# EAGLE design PowerRhythm32 (EAGLE 6.4)
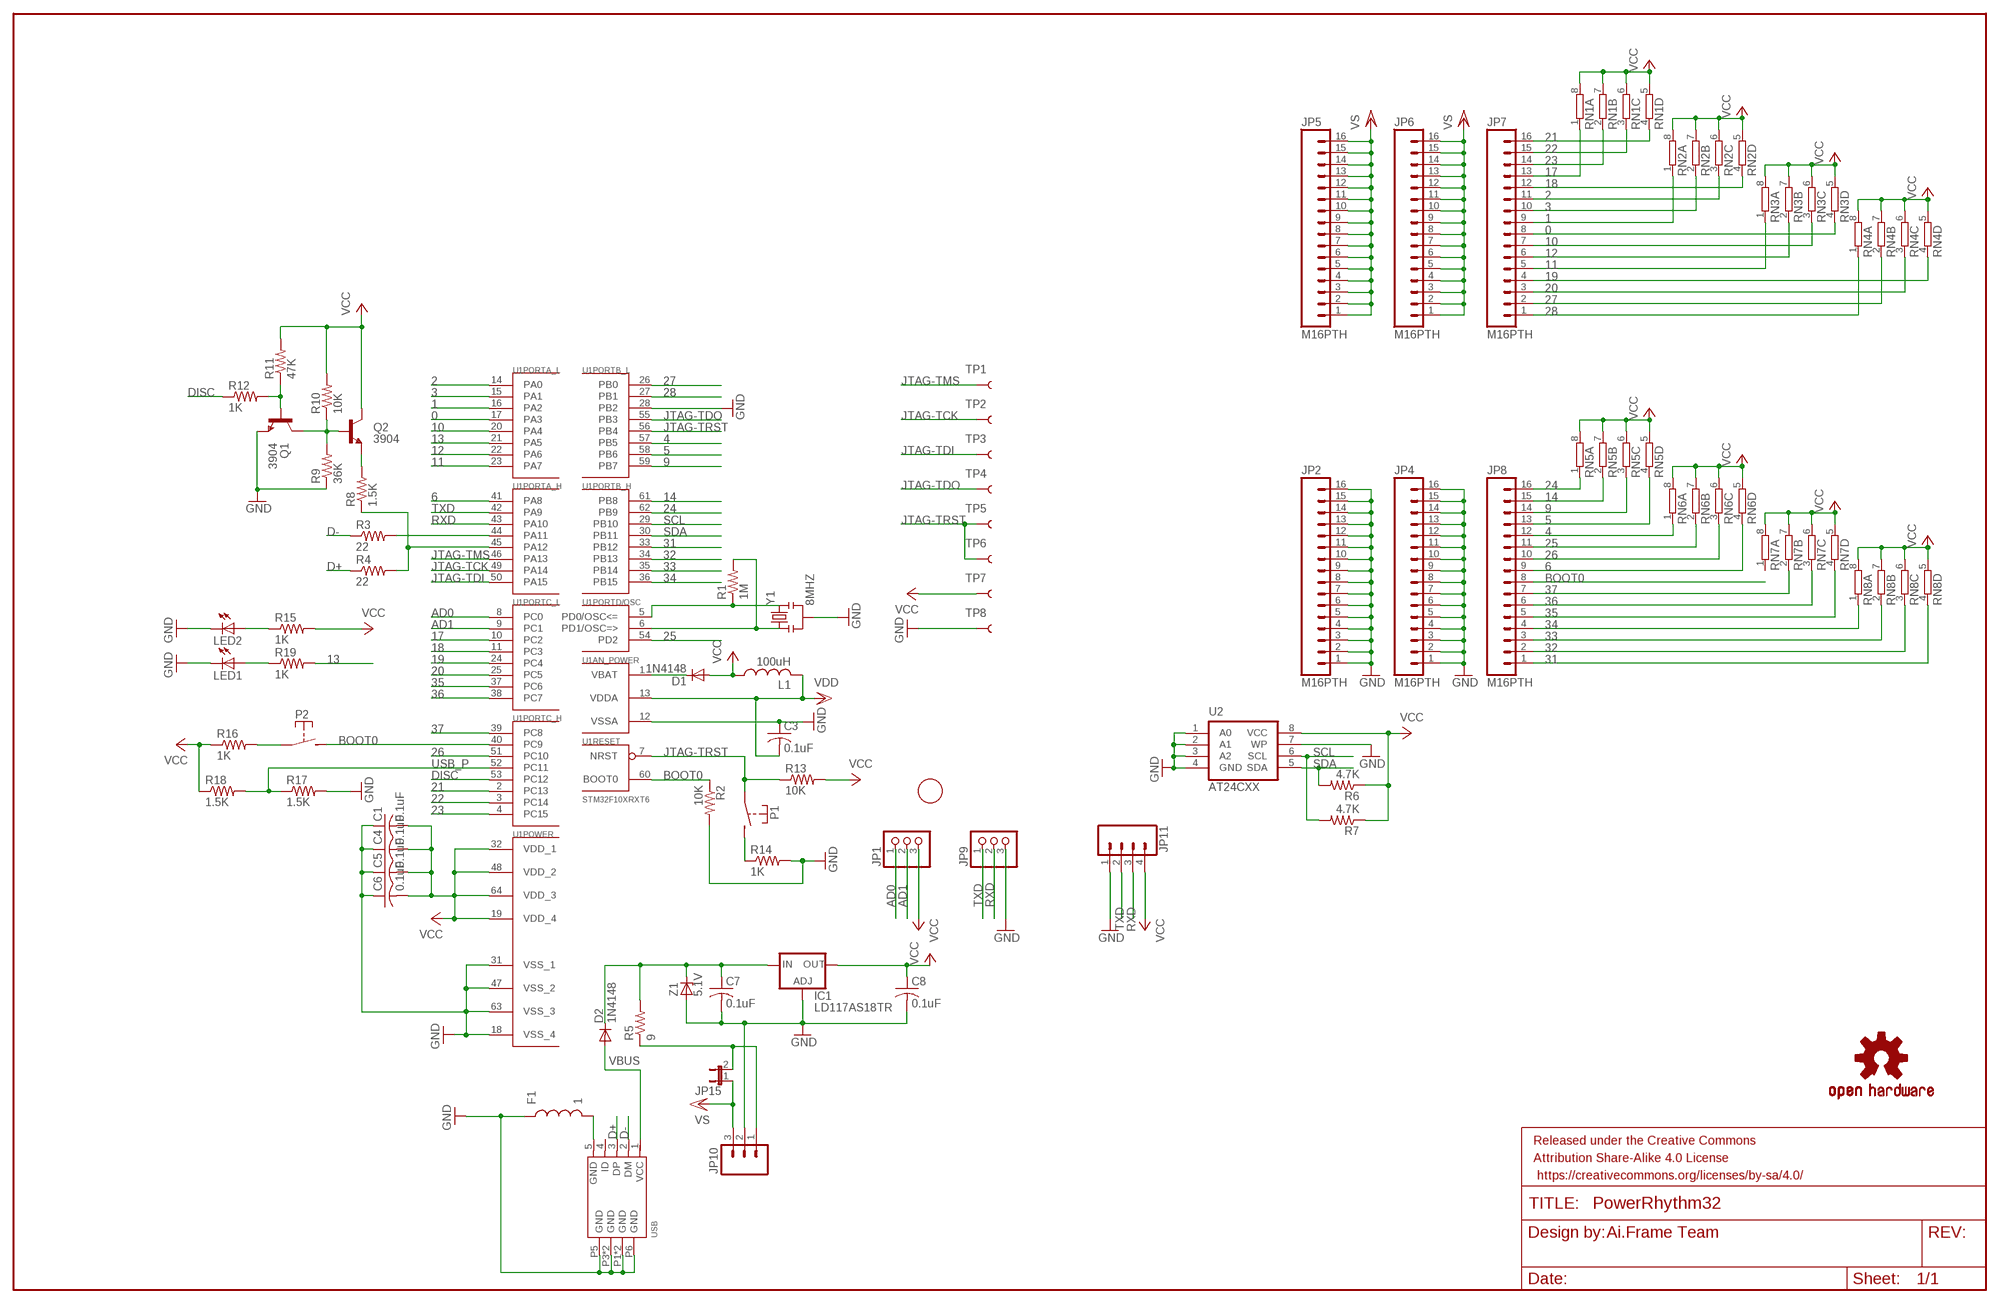
[diagram p0: schematic, sheet 1]

## Parts
C1  0.1uF  C-USC0603K  [C0603K]
C3  0.1uF  C-USC0603K  [C0603K]
C4  0.1uF  C-USC0603K  [C0603K]
C5  0.1uF  C-USC0603K  [C0603K]
C6  0.1uF  C-USC0603K  [C0603K]
C7  0.1uF  C-USC0603K  [C0603K]
C8  0.1uF  C-USC0603K  [C0603K]
D1  1N4148  DIODE-SOD123  [SOD123]
D2  1N4148  DIODE-SOD123  [SOD123]
F1  1  INDUCTOR0805  [0805]
FRAME1  FRAME-LEDGER  [CREATIVE_COMMONS]
IC1  LD117AS18TR  [SOT223]
JP1  PINHD-1X3  [1X03]
JP2  M16PTH  [1X16]
JP4  M16PTH  [1X16]
JP5  M16PTH  [1X16]
JP6  M16PTH  [1X16]
JP7  M16PTH  [1X16]
JP8  M16PTH  [1X16]
JP9  PINHD-1X3  [1X03]
JP10  M03SCREW_LOCK  [SCREWTERMINAL-3.5MM-3_LOCK.007S]
JP11  M04PTH  [1X04]
JP15  JUMPER-2PTH  [1X02]
L1  100uH  L-USL2012C  [L2012C]
LED1  LEDCHIP-LED0603  [CHIP-LED0603]
LED2  LEDCHIP-LED0603  [CHIP-LED0603]
LOGO1  OSHW-LOGOS  [OSHW-LOGO-S]
P1  TMAV433BAA  [TMAV433BAA]
P2  TMAV433BAA  [TMAV433BAA]
Q1  3904  TRANSISTOR_NPNMMBT2222A  [SOT23-3]
Q2  3904  TRANSISTOR_NPNMMBT2222A  [SOT23-3]
R1  1M  R-US_R0603  [R0603]
R2  10K  R-US_R0603  [R0603]
R3  22  R-US_R0603  [R0603]
R4  22  R-US_R0603  [R0603]
R5  9  R-US_R1206  [R1206]
R6  4.7K  R-US_R0603  [R0603]
R7  4.7K  R-US_R0603  [R0603]
R8  1.5K  R-US_R0603  [R0603]
R9  36K  R-US_R0603  [R0603]
R10  10K  R-US_R0603  [R0603]
R11  47K  R-US_R0603  [R0603]
R12  1K  R-US_R0603  [R0603]
R13  10K  R-US_R0603  [R0603]
R14  1K  R-US_R0603  [R0603]
R15  1K  R-US_R0603  [R0603]
R16  1K  R-US_R0603  [R0603]
R17  1.5K  R-US_R0603  [R0603]
R18  1.5K  R-US_R0603  [R0603]
R19  1K  R-US_R0603  [R0603]
RN1  4R-N0603-ARC  [0603-ARC]
RN2  4R-N0603-ARC  [0603-ARC]
RN3  4R-N0603-ARC  [0603-ARC]
RN4  4R-N0603-ARC  [0603-ARC]
RN5  4R-N0603-ARC  [0603-ARC]
RN6  4R-N0603-ARC  [0603-ARC]
RN7  4R-N0603-ARC  [0603-ARC]
RN8  4R-N0603-ARC  [0603-ARC]
TP1  TEST-POINT3X5  [PAD.03X.05]
TP2  TEST-POINT3X5  [PAD.03X.05]
TP3  TEST-POINT3X5  [PAD.03X.05]
TP4  TEST-POINT3X5  [PAD.03X.05]
TP5  TEST-POINT3X5  [PAD.03X.05]
TP6  TEST-POINT3X5  [PAD.03X.05]
TP7  TEST-POINT3X5  [PAD.03X.05]
TP8  TEST-POINT3X5  [PAD.03X.05]
U1  STM32F10XRXT6  [TQFP64]
U2  AT24CXX  [SO08-8S1]
U$1  FIDUCIAL  [FIDUCIAL_1MM]
USB  MICRO-USB5+4P'5+6P'  [MICRO-USB5+6P-SMD-0.65-AB]
Y1  8MHZ  RESONATOR8MHZ  [RESONATOR-SMD]
Z1  5.1V  ZENER-DIODESOD80C  [SOD80C]

## Nets
0: JP7.8 RN3.4 U1.17(PORTA_L:PA3)
1: JP7.9 RN2.1 U1.16(PORTA_L:PA2)
2: JP7.11 RN2.3 U1.14(PORTA_L:PA0)
3: JP7.10 RN2.2 U1.15(PORTA_L:PA1)
4: JP8.12 RN6.1 U1.57(PORTB_L:PB5)
5: JP8.13 RN5.4 U1.58(PORTB_L:PB6)
6: JP8.9 RN6.4 U1.41(PORTA_H:PA8)
9: JP8.14 RN5.3 U1.59(PORTB_L:PB7)
10: JP7.7 RN3.3 U1.20(PORTA_L:PA4)
11: JP7.5 RN3.1 U1.23(PORTA_L:PA7)
12: JP7.6 RN3.2 U1.22(PORTA_L:PA6)
13: R19.2 U1.21(PORTA_L:PA5)
14: JP8.15 RN5.2 U1.61(PORTB_H:PB8)
17: JP7.13 RN1.1 U1.10(PORTC_L:PC2)
18: JP7.12 RN2.4 U1.11(PORTC_L:PC3)
19: JP7.4 RN4.4 U1.24(PORTC_L:PC4)
20: JP7.3 RN4.3 U1.25(PORTC_L:PC5)
21: JP7.16 RN1.4 U1.2(PORTC_H:PC13)
22: JP7.15 RN1.3 U1.3(PORTC_H:PC14)
23: JP7.14 RN1.2 U1.4(PORTC_H:PC15)
24: JP8.16 RN5.1 U1.62(PORTB_H:PB9)
25: JP8.11 RN6.2 U1.54(PORTD/OSC:PD2)
26: JP8.10 RN6.3 U1.51(PORTC_H:PC10)
27: JP7.2 RN4.2 U1.26(PORTB_L:PB0)
28: JP7.1 RN4.1 U1.27(PORTB_L:PB1)
31: JP8.1 RN8.4 U1.33(PORTB_H:PB12)
32: JP8.2 RN8.3 U1.34(PORTB_H:PB13)
33: JP8.3 RN8.2 U1.35(PORTB_H:PB14)
34: JP8.4 RN8.1 U1.36(PORTB_H:PB15)
35: JP8.5 RN7.4 U1.37(PORTC_L:PC6)
36: JP8.6 RN7.3 U1.38(PORTC_L:PC7)
37: JP8.7 RN7.2 U1.39(PORTC_H:PC8)
AD0: JP1.1 U1.8(PORTC_L:PC0)
AD1: JP1.2 U1.9(PORTC_L:PC1)
BOOT0: JP8.8 P2.P$2(S) R2.1 U1.40(PORTC_H:PC9) U1.60(RESET:BOOT0)
D+: R4.1 USB.3(DP)
D-: R3.1 USB.2(DM)
DISC: R12.1 U1.53(PORTC_H:PC12)
GND: C1.1 C3.1 C4.1 C5.1 C6.1 C7.2 C8.2 F1.1 IC1.1(ADJ) JP2.1 JP2.2 JP2.3 JP2.4 JP2.5 JP2.6 JP2.7 JP2.8 JP2.9 JP2.10 JP2.11 JP2.12 JP2.13 JP2.14 JP2.15 JP2.16 JP4.1 JP4.2 JP4.3 JP4.4 JP4.5 JP4.6 JP4.7 JP4.8 JP4.9 JP4.10 JP4.11 JP4.12 JP4.13 JP4.14 JP4.15 JP4.16 JP9.3 JP10.2 JP11.1 LED1.C LED2.C Q1.2(E) R2.2 R9.1 R14.2 R17.2 TP8.P$1 U1.12(AN_POWER:VSSA) U1.18(POWER:VSS_4) U1.28(PORTB_L:PB2) U1.31(POWER:VSS_1) U1.47(POWER:VSS_2) U1.63(POWER:VSS_3) U2.1(A0) U2.2(A1) U2.3(A2) U2.4(GND) U2.7(WP) USB.P1(GND) USB.P2(GND) USB.P3(GND) USB.P4(GND) USB.P5(GND) USB.P6(GND) Y1.2 Z1.A
JTAG-TCK: TP2.P$1 U1.49(PORTA_H:PA14)
JTAG-TDI: TP3.P$1 U1.50(PORTA_H:PA15)
JTAG-TDO: TP4.P$1 U1.55(PORTB_L:PB3)
JTAG-TMS: TP1.P$1 U1.46(PORTA_H:PA13)
JTAG-TRST: P1.P$1(P) R13.1 TP5.P$1 TP6.P$1 U1.7(RESET:NRST) U1.56(PORTB_L:PB4)
N$1: R1.2 U1.6(PORTD/OSC:PD1/OSC=>) Y1.1
N$2: D1.C U1.1(AN_POWER:VBAT)
N$3: LED2.A R15.1
N$4: R4.2 R8.1 U1.45(PORTA_H:PA12)
N$5: JP10.1 JP15.2 R5.1
N$6: R1.1 U1.5(PORTD/OSC:PD0/OSC<=) Y1.3
N$8: R3.2 U1.44(PORTA_H:PA11)
N$9: C7.1 D2.C IC1.3(IN) R5.2 Z1.C
N$11: LED1.A R19.1
N$12: F1.2 USB.5(GND)
N$14: Q1.3(C) Q2.1(B) R9.2 R10.1
N$15: P1.P$2(S) R14.1
N$16: Q2.2(E) R8.2
N$17: Q1.1(B) R11.1 R12.2
N$19: P2.P$1(P) R16.2
RXD: JP9.2 JP11.3 U1.43(PORTA_H:PA10)
SCL: R7.2 U1.29(PORTB_H:PB10) U2.6(SCL)
SDA: R6.2 U1.30(PORTB_H:PB11) U2.5(SDA)
TXD: JP9.1 JP11.2 U1.42(PORTA_H:PA9)
USB_P: R17.1 R18.2 U1.52(PORTC_H:PC11)
VBUS: D2.A USB.1(VCC)
VCC: C1.2 C4.2 C5.2 C6.2 C8.1 D1.A IC1.4(OUT) JP1.3 JP11.4 L1.1 Q2.3(C) R6.1 R7.1 R10.2 R11.2 R13.2 R15.2 R16.1 R18.1 RN1.5 RN1.6 RN1.7 RN1.8 RN2.5 RN2.6 RN2.7 RN2.8 RN3.5 RN3.6 RN3.7 RN3.8 RN4.5 RN4.6 RN4.7 RN4.8 RN5.5 RN5.6 RN5.7 RN5.8 RN6.5 RN6.6 RN6.7 RN6.8 RN7.5 RN7.6 RN7.7 RN7.8 RN8.5 RN8.6 RN8.7 RN8.8 TP7.P$1 U1.19(POWER:VDD_4) U1.32(POWER:VDD_1) U1.48(POWER:VDD_2) U1.64(POWER:VDD_3) U2.8(VCC)
VCC/2: JP5.1 JP5.2 JP5.3 JP5.4 JP5.5 JP5.6 JP5.7 JP5.8 JP5.9 JP5.10 JP5.11 JP5.12 JP5.13 JP5.14 JP5.15 JP5.16 JP6.1 JP6.2 JP6.3 JP6.4 JP6.5 JP6.6 JP6.7 JP6.8 JP6.9 JP6.10 JP6.11 JP6.12 JP6.13 JP6.14 JP6.15 JP6.16 JP10.3 JP15.1 ; supply symbol labelled VS
VDD: C3.2 L1.2 U1.13(AN_POWER:VDDA)
Unconnected: RN7.1 USB.4(ID)

## Notes on the sheet
- Ai.Frame Team

## Library data of the parts
C1 C3-C8 = resistor:C-US: CAPACITOR, American symbol
D1 D2 = diode:DIODE-: DIODE
F1 = SparkFun-Passives:INDUCTOR: Inductors Basic Inductor/Choke - 0603 and 1206. Footprints are not proven and vary greatly between part numbers. SRN6045- 33uH, 20% 1.4A SDR0403-560KL - 56uH, 10%, 500mA RMS/740mA peak
FRAME1 = SparkFun-Aesthetics:FRAME-LEDGER: Schematic Frame Standard 11x14 US Ledger frame
IC1 = v-reg:LD117A?*: Low drop fixed and adjustable positive voltage regulators 1 A Source: http://www.st.com/stonline/products/literature/ds/7194/ld1117axx.pdf
JP1 JP9 = adafruit:PINHD-1X3: PIN HEADER
JP2 JP4-JP8 = SparkFun-Connectors:M16: 1x16 .1" header
JP10 = SparkFun-Connectors:M03: Header 3 Standard 3-pin 0.1" header. Use with straight break away headers (SKU : PRT-00116), right angle break away headers (PRT-00553), swiss pins (PRT-00743), machine pins (PRT-00117), and female headers (PRT-00115). Molex polarized connector foot print use with SKU : PRT-08232 with associated crimp pins and housings.
JP11 = SparkFun-Connectors:M04: Header 4 Standard 4-pin 0.1" header. Use with straight break away headers (SKU : PRT-00116), right angle break away headers (PRT-00553), swiss pins (PRT-00743), machine pins (PRT-00117), and female headers (PRT-00115). Molex polarized connector foot print use with SKU : PRT-08231 with associated crimp pins and housings. 1MM SMD Version SKU: PRT-10208
JP15 = SparkFun-Passives:JUMPER-2: Jumper Basic 0.1" spaced jumper. Use with breakaway headers.
L1 = resistor:L-US: INDUCTOR, American symbol
LED1 LED2 = adafruit:LED: LED OSRAM: - CHIPLED LG R971, LG N971, LY N971, LG Q971, LY Q971, LO R971, LY R971 LH N974, LH R974 LS Q976, LO Q976, LY Q976 LO Q996 - Hyper CHIPLED LW Q18S LB Q993, LB Q99A, LB R99A - SideLED LS A670, LO A670, LY A670, LG A670, LP A670 LB A673, LV A673, LT A673, LW A673 LH A674 LY A675 LS A676, LA A676, LO A676, LY A676, LW A676 LS A679, LY A679, LG A679 - Hyper Micro SIDELED® LS Y876, LA Y876, LO Y876, LY Y876 LT Y87S - SmartLED LW L88C, LW L88S LB L89C, LB L89S, LG L890 LS L89K, LO L89K, LY L89K LS L896, LA L896, LO L896, LY L896 - TOPLED LS T670, LO T670, LY T670, LG T670, LP T670 LSG T670, LSP T670, LSY T670, LOP T670, LYG T670 LG T671, LOG T671, LSG T671 LB T673, LV T673, LT T673, LW T673 LH T674 LS T676, LA T676, LO T676, LY T676, LB T676, LH T676, LSB T676, LW T676 LB T67C, LV T67C, LT T67C, LS T67K, LO T67K, LY T67K, LW E67C LS E67B, LA E67B, LO E67B, LY E67B, LB E67C, LV E67C, LT E67C LW T67C LS T679, LY T679, LG T679 LS T770, LO T770, LY T770, LG T770, LP T770 LB T773, LV T773, LT T773, LW T773 LH T774 LS E675, LA E675, LY E675, LS T675 LS T776, LA T776, LO T776, LY T776, LB T776 LHGB T686 LT T68C, LB T68C - Hyper Mini TOPLED® LB M676 - Mini TOPLED Santana® LG M470 LS M47K, LO M47K, LY M47K Source: http://www.osram.convergy.de/
LOGO1 = SparkFun-Aesthetics:OSHW-LOGO: Open Source Hardware Logo This logo indicates the piece of hardware it is found on incorporates a OSHW license and/or adheres to the definition of open source hardware found here: http://freedomdefined.org/OSHW
P1 P2 = switch-misc:TMAV433BAA
Q1 Q2 = SparkFun-DiscreteSemi:TRANSISTOR_NPN: Generic NPN BJT MMBT2222A - TRANS-08049 (SOT-23, 1A 40V) MPSA42 - TRANS-09116 (SOT-23, 500mA 300V) MMBT5088LT1G - TRANS-11160 (SOT-23, 50 mA 30V); PROD_ID: TRANS-08049; VALUE: MMBT2222A
R1-R19 = resistor:R-US_: RESISTOR, American symbol
RN1-RN8 = resistor-dil:4R-N: Array Chip Resistor Source: RS Component / Phycomp; OC_FARNELL: unknown; OC_NEWARK: unknown
TP1-TP8 = SparkFun-Passives:TEST-POINT: Bare copper test points for troubleshooting or ICT
U1 = stm32:STM32F10XRXT6: STM32F101/103 64pin LQFP
U2 = memory-atmel:AT24CXX: EEPROM SPI bus serial
U$1 = adafruit:FIDUCIAL: For use by pick and place machines to calibrate the vision/machine, 1mm By microbuilder.eu
USB = Connector-new:MICRO-USB5+4P: 5+4P-SMD-0.65-B:320010000;5+2P-SMD-0.65-AB:340032001
Y1 = SparkFun-FreqCtrl:RESONATOR: Resonator Small SMD resonator. Used, eg, on the Arduino Pro/ Pro Mini boards. 8MHz- XTAL-08895 16MHz- XTAL-08900; PROD_ID: XTAL-08895
Z1 = diode:ZENER-DIODE: Z-Diode

## Board
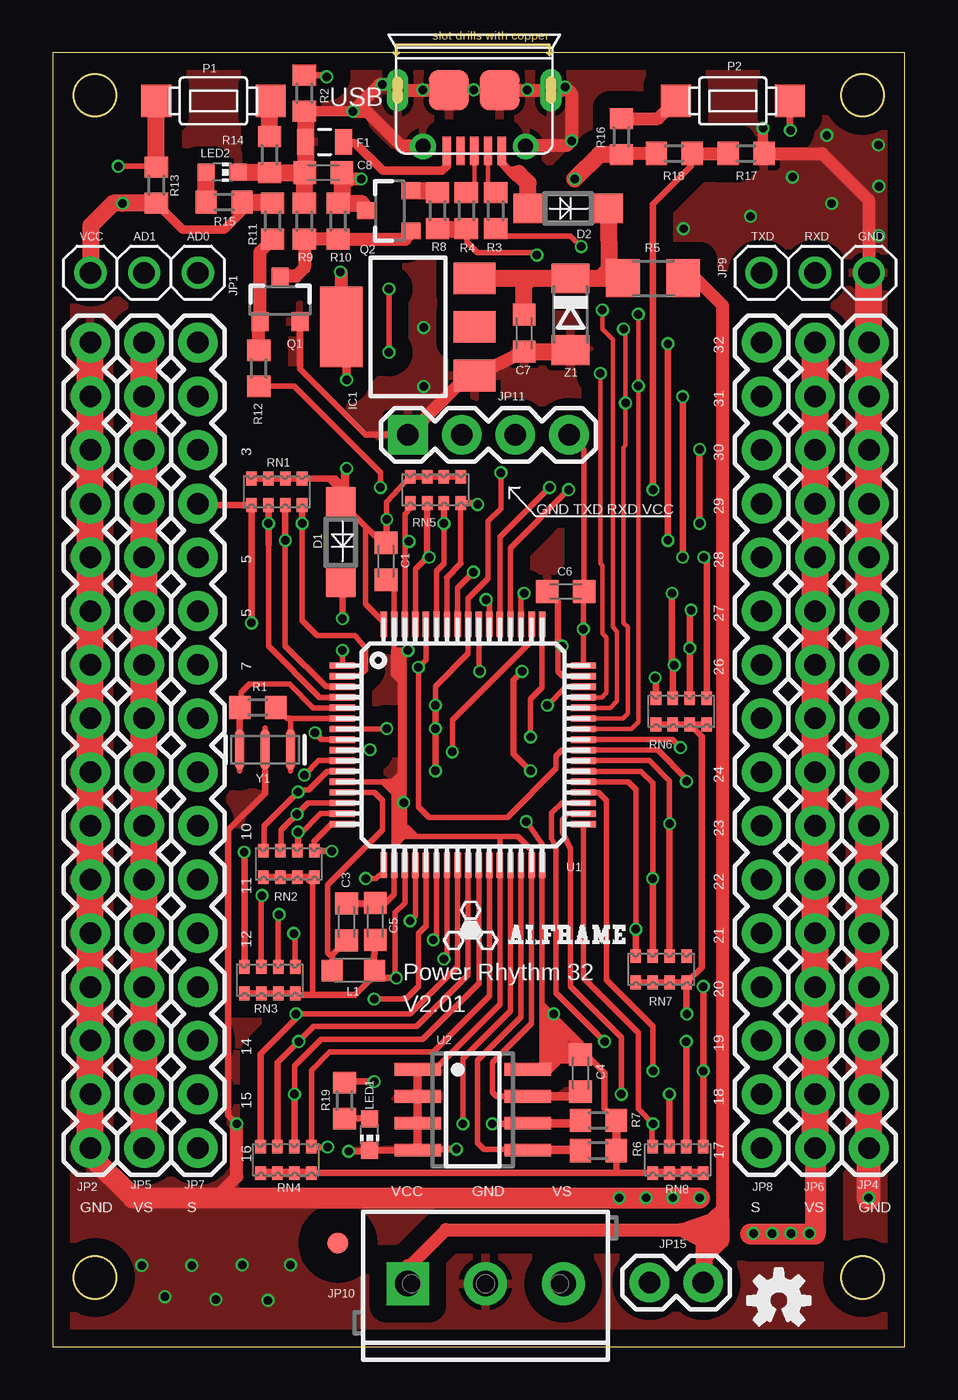
[diagram p1: board, top side]
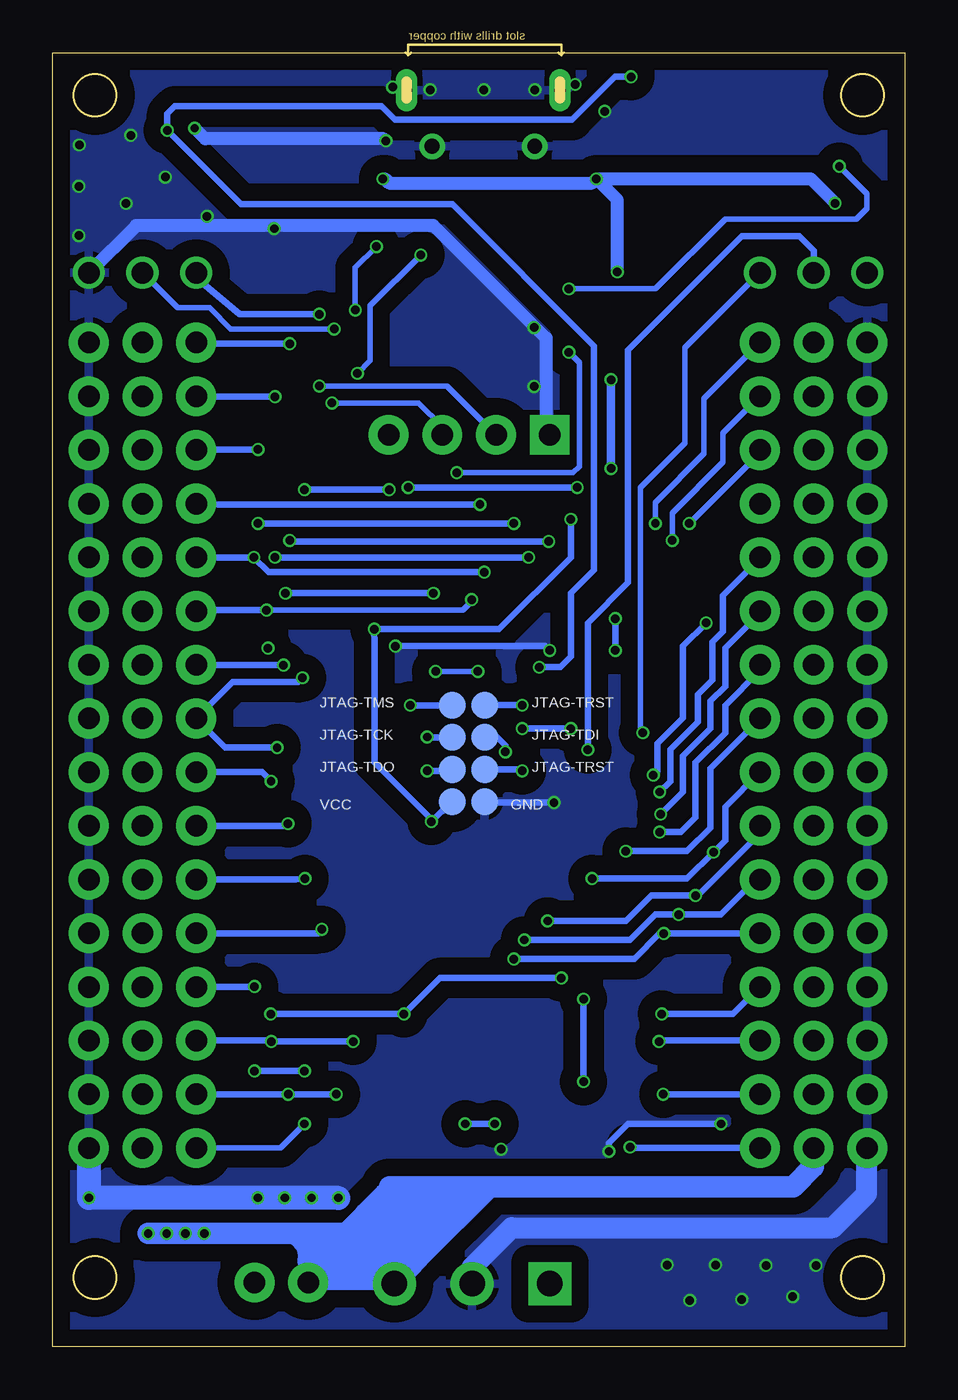
[diagram p2: board, bottom side, seen from below]

Size 40.31 x 61.2 mm. Coordinates in mm from the lower left corner, seen from the top.
Outline: 0,0 40.31,0 40.31,61.2 0,61.2 0,0
Outline: circle at 2,3.27 radius 1
Outline: circle at 38.31,3.27 radius 1
Outline: circle at 38.31,59.2 radius 1
Outline: circle at 2,59.2 radius 1
Copper layers (1*16): Top_Copper 0.035mm / dielectric 1.5mm / Bottom_Copper 0.035mm
Design rules "default *": minimum track width 8mil, minimum drill 15mil, track to track 8mil, track to pad 6mil, pad to pad 5mil, via to via 8mil, smd to smd 0mil, copper to edge 10mil, drill to drill 8mil, minimum pad ring 10mil, minimum via ring 2.5mil, stop-mask expansion 4mil, vias tented up to drill 25mil, thermal gap 10mil
Holes 0.4 mm at 74.66,14
Holes 1.02 mm at 74.66,8.92
Holes 1.2 mm at 74.66,3.84

### Footprints (pad centres in the part's own frame; a part is rotated, then mirrored left to right if it is on the bottom)
C0603K = smd 1.05 x 1.08: 1 -0.875,0; 2 0.875,0
SOD123 = smd 1.4 x 1.4: A 1.9,0; C -1.9,0
0805 = smd 0.8 x 1.2: 1 -0.9,0; 2 0.9,0
SOT223 = smd 1.5 x 2: 1 -2.3,-3.15; 2 0,-3.15; 3 2.3,-3.15 | smd 3.8 x 2: 4 0,3.15
1X03 = drill 1.016: 1 -2.54,0; 2 0,0; 3 2.54,0
1X16 = drill 1.016 pad 1.88: 1 0,0; 2 2.54,0; 3 5.08,0; 4 7.62,0; 5 10.16,0; 6 12.7,0; 7 15.24,0; 8 17.78,0; 9 20.32,0; 10 22.86,0; 11 25.4,0; 12 27.94,0; 13 30.48,0; 14 33.02,0; 15 35.56,0; 16 38.1,0
SCREWTERMINAL-3.5MM-3_LOCK.007S = drill 1.2 pad 2.032 square: 1 -0.178,0 | drill 1.2 pad 2.032: 2 3.5,0; 3 7.178,0
1X04 = drill 1.016 pad 1.88 square: 1 0,0 | drill 1.016 pad 1.88: 2 2.54,0; 3 5.08,0; 4 7.62,0
1X02 = drill 1.016 pad 1.88: 1 0,0; 2 2.54,0
L2012C = smd 1 x 1: 1 -1,0; 2 1,0
CHIP-LED0603 = smd 0.8 x 0.8: A 0,-0.75; C 0,0.75
TMAV433BAA = smd 1.524 x 1.422: P$1 0,2.699; P$2 0,-2.699
SOT23-3 = smd 0.8 x 0.9: 1 -0.95,-1; 2 0.95,-1; 3 0,1.1
R0603 = smd 1 x 1.1: 1 -0.85,0; 2 0.85,0
R1206 = smd 1.6 x 1.803: 1 -1.422,0; 2 1.422,0
0603-ARC = smd 0.5 x 0.65: 1 -1.2,-0.625; 2 -0.4,-0.625; 3 0.4,-0.625; 4 1.2,-0.625; 5 1.2,0.625; 6 0.4,0.625; 7 -0.4,0.625; 8 -1.2,0.625
PAD.03X.05 = smd 1.27 x 1.27: P$1 0,0
TQFP64 = smd 1.2 x 0.3: 1 -5.7,3.75; 2 -5.7,3.25; 3 -5.7,2.75; 4 -5.7,2.25; 5 -5.7,1.75; 6 -5.7,1.25; 7 -5.7,0.75; 8 -5.7,0.25; 9 -5.7,-0.25; 10 -5.7,-0.75; 11 -5.7,-1.25; 12 -5.7,-1.75; 13 -5.7,-2.25; 14 -5.7,-2.75; 15 -5.7,-3.25; 16 -5.7,-3.75; 33 5.7,-3.75; 34 5.7,-3.25; 35 5.7,-2.75; 36 5.7,-2.25; 37 5.7,-1.75; 38 5.7,-1.25; 39 5.7,-0.75; 40 5.7,-0.25; 41 5.7,0.25; 42 5.7,0.75; 43 5.7,1.25; 44 5.7,1.75; 45 5.7,2.25; 46 5.7,2.75; 47 5.7,3.25; 48 5.7,3.75 | smd 0.3 x 1.2: 17 -3.75,-5.7; 18 -3.25,-5.7; 19 -2.75,-5.7; 20 -2.25,-5.7; 21 -1.75,-5.7; 22 -1.25,-5.7; 23 -0.75,-5.7; 24 -0.25,-5.7; 25 0.25,-5.7; 26 0.75,-5.7; 27 1.25,-5.7; 28 1.75,-5.7; 29 2.25,-5.7; 30 2.75,-5.7; 31 3.25,-5.7; 32 3.75,-5.7; 49 3.75,5.7; 50 3.25,5.7; 51 2.75,5.7; 52 2.25,5.7; 53 1.75,5.7; 54 1.25,5.7; 55 0.75,5.7; 56 0.25,5.7; 57 -0.25,5.7; 58 -0.75,5.7; 59 -1.25,5.7; 60 -1.75,5.7; 61 -2.25,5.7; 62 -2.75,5.7; 63 -3.25,5.7; 64 -3.75,5.7
SO08-8S1 = smd 0.6 x 2.2: 1 -1.905,-2.6; 2 -0.635,-2.6; 3 0.635,-2.6; 4 1.905,-2.6; 5 1.905,2.6; 6 0.635,2.6; 7 -0.635,2.6; 8 -1.905,2.6
FIDUCIAL_1MM = smd 1 x 1: 1 0,0
MICRO-USB5+6P-SMD-0.65-AB = smd 0.4 x 1.35: 1 -1.3,2.875; 2 -0.65,2.875; 3 0,2.875; 4 0.65,2.875; 5 1.3,2.875 | smd 1.9 x 1.9: P1 -1.2,0; P2 1.2,0 | drill 0.508 pad 1.016 long: P3 -3.625,0; P4 3.625,0 | drill 0.7: P5 -2.425,2.65; P6 2.425,2.65
RESONATOR-SMD = smd 0.45 x 1.905: 1 -1.2,0; 2 0,0; 3 1.2,0
SOD80C = smd 1.4 x 1.8: A 1.7,0; C -1.7,0

### Placement (x,y rotation side)
C1  15.76,37.15 90 top
C3  13.9,20.09 270 top
C4  24.97,12.94 90 top
C5  15.26,20.11 270 top
C6  24.26,35.72 0 top
C7  22.3,47.94 270 top
C8  12.8,55.54 180 top
D1  13.63,38.05 90 top
D2  24.38,53.84 180 top
F1  12.85,56.99 0 top
FRAME1  86.46,28.98 0 top  (outside the outline)
IC1  16.8,48.24 90 top
JP1  4.32,50.8 180 top
JP2  1.78,9.4 90 top
JP4  38.61,9.4 90 top
JP5  4.32,9.4 90 top
JP6  36.07,9.4 90 top
JP7  6.86,9.4 90 top
JP8  33.53,9.4 90 top
JP9  36.07,50.8 0 top
JP10  16.97,2.98 0 top
JP11  16.8,43.13 0 top
JP15  28.23,3.03 0 top
L1  14.21,17.79 180 top
LED1  14.99,10.03 180 top
LED2  8.01,55.55 270 top
LOGO1  34.35,2.19 0 top
P1  7.6,58.93 90 top
P2  32.17,58.93 90 top
Q1  10.75,49.49 0 top
Q2  15.95,53.73 90 top
R1  9.7,30.24 0 top
R2  11.9,59.29 270 top
R3  20.95,53.74 270 top
R4  19.56,53.74 270 top
R5  28.4,50.54 180 top
R6  25.81,9.28 180 top
R7  25.81,10.71 180 top
R8  18.2,53.74 90 top
R9  11.9,53.24 270 top
R10  13.5,53.24 90 top
R11  10.4,53.24 90 top
R12  9.74,46.28 90 top
R13  4.9,54.94 270 top
R14  10.25,56.38 270 top
R15  8.1,54.14 0 top
R16  26.9,57.24 90 top
R17  32.8,56.44 0 top
R18  29.4,56.44 0 top
R19  13.8,11.64 90 top
RN1  10.59,40.44 0 top
RN2  11.17,22.84 180 top
RN3  10.26,17.34 180 top
RN4  11.03,8.84 180 top
RN5  18.11,40.53 0 top
RN6  29.73,30.05 180 top
RN7  28.78,17.85 180 top
RN8  29.57,8.84 180 top
TP1  21.41,30.35 180 bottom
TP2  21.41,28.83 180 bottom
TP3  19.88,28.83 180 bottom
TP4  21.41,27.3 180 bottom
TP5  19.88,27.3 180 bottom
TP6  19.88,30.35 180 bottom
TP7  21.41,25.78 180 bottom
TP8  19.88,25.78 180 bottom
U1  19.4,28.47 0 top
U2  19.86,11.21 270 top
U$1  13.49,4.9 0 top
USB  19.94,59.44 180 top
Y1  10.04,28.24 180 top
Z1  24.5,48.84 270 top

### Tracks (layer width: path | path; a pad name or v marks a point on that pad's centre or on a via)
0  (via drill 0.4 pad 0.61)
  Top_Copper 0.254: U1.17 15.65,22.49 15.3,22.14 v14.8,22.14
  Top_Copper 0.305: RN3.4 9.06,23.38 v9.05,23.39
  Bottom_Copper 0.305: v14.8,22.14 10.3,22.14 v9.05,23.39 8.5,23.94 8.5,25.54 JP7.8
1  (via drill 0.4 pad 0.61)
  Top_Copper 0.254: 13.62,24.72 U1.16 13.18,24.72 12.37,23.91 RN2.1
  Top_Copper 0.305: v13.2,23.44 12.39,23.44 RN2.1
  Bottom_Copper 0.305: JP7.9 6.86,29.68 9.2,27.34 9.2,24.54 10.3,23.44 v13.2,23.44
2  (via drill 0.4 pad 0.61)
  Top_Copper 0.254: U1.14 12.08,25.72 v11.55,25.19 10.8,24.44 10.8,23.5
  Top_Copper 0.305: 10.8,23.5 RN2.3
  Bottom_Copper 0.305: JP7.11 6.86,34.68 8.5,33.04 8.5,31.24 9.2,30.54 9.2,29.24 10.5,27.94 10.5,26.24 v11.55,25.19
3  (via drill 0.4 pad 0.61)
  Top_Copper 0.254: U1.15 12.68,25.22 11.7,24.24
  Top_Copper 0.305: RN2.2 11.6,23.5 v11.6,24.34 11.7,24.24
  Bottom_Copper 0.305: JP7.10 6.86,31.98 8.5,30.34 8.5,29.04 9.9,27.64 9.9,25.04 10.6,24.34 v11.6,24.34
4  (via drill 0.4 pad 0.61)
  Top_Copper 0.254: U1.57 19.15,35.89 v19.9,36.64
  Top_Copper 0.305: RN6.1 30.93,37.21 v30.8,37.34
  Bottom_Copper 0.305: JP8.12 v30.8,37.34 30.1,36.64 v19.9,36.64
5  (via drill 0.4 pad 0.61)
  Top_Copper 0.254: U1.58 18.65,36.39 | 19.3,37.04 RN5.4
  Top_Copper 0.305: 18.65,36.39 19.3,37.04 | RN5.4 20.04,39.9 v20.1,39.84
  Bottom_Copper 0.305: v20.1,39.84 32.49,39.84 JP8.13
6  (via drill 0.4 pad 0.61)
  Top_Copper 0.254: U1.41 29.32,28.72 v29.7,28.34
  Top_Copper 0.305: RN6.4 28.53,31.41 v28.5,31.64
  Bottom_Copper 0.305: v29.7,28.34 32.15,28.34 JP8.9 31.81,31.44 28.7,31.44 v28.5,31.64
9  (via drill 0.4 pad 0.61)
  Top_Copper 0.254: U1.59 18.15,36.69 18.5,37.04 v18.5,38.94
  Top_Copper 0.305: v18.5,38.94 RN5.3 | v30.6,38.94 v30.6,42.44
  Bottom_Copper 0.305: v18.5,38.94 v30.6,38.94 | v30.6,42.44 33.51,42.44 JP8.14
10  (via drill 0.4 pad 0.61)
  Top_Copper 0.254: U1.20 17.15,20.39 v16.9,20.14 | RN3.3 9.86,21.3 v9.9,21.34
  Bottom_Copper 0.305: v16.9,20.14 13.2,20.14 12,21.34 v9.9,21.34 9.7,21.44 6.86,24.28 JP7.7
11  (via drill 0.4 pad 0.61)
  Top_Copper 0.254: U1.23 18.65,18.49 v18.5,18.34 | RN3.1 11.46,19.5 v11.4,19.54
  Bottom_Copper 0.305: JP7.5 6.88,19.54 v11.4,19.54 11.6,19.54 12.8,18.34 v18.5,18.34
12  (via drill 0.4 pad 0.61)
  Top_Copper 0.254: U1.22 18.15,19.39 v18,19.24 | RN3.2 10.66,20.3 v10.7,20.44
  Bottom_Copper 0.305: JP7.6 6.9,22.14 7,22.14 8.7,20.44 v10.7,20.44 11.8,20.44 13,19.24 v18,19.24
13  (via drill 0.4 pad 0.61)
  Top_Copper 0.254: v15.2,16.44 16.7,16.44 17.3,17.04 17.3,19.54 17.65,19.89 U1.21
  Top_Copper 0.305: v15.2,12.54 13.85,12.54 R19.2
  Bottom_Copper 0.305: v15.2,16.44 v15.2,12.54
14  (via drill 0.4 pad 0.61)
  Top_Copper 0.254: U1.61 17.15,36.79 17.7,37.34
  Top_Copper 0.305: RN5.2 17.7,37.34 v17.8,37.34 | v29.8,37.34 v29.8,44.94
  Bottom_Copper 0.305: v17.8,37.34 v29.8,37.34 | v29.8,44.94 33.51,44.94 JP8.15
17  (via drill 0.4 pad 0.61)
  Top_Copper 0.254: U1.10 12.58,27.72 v11.9,27.04
  Top_Copper 0.305: v9.4,34.24 RN1.1 6.92,39.82 JP7.13
  Bottom_Copper 0.305: v9.4,34.24 10.5,33.14 10.5,29.74 11.7,28.54 11.7,27.24 v11.9,27.04
18  (via drill 0.4 pad 0.61)
  Top_Copper 0.254: v11.6,26.24 10,24.64 10,23.5 | U1.11 12.98,27.22 12.1,26.34 11.7,26.34
  Top_Copper 0.305: 10,23.5 RN2.4 | 11.7,26.34 v11.6,26.24
  Bottom_Copper 0.305: JP7.12 6.86,37.28 8.6,35.54 8.6,33.84 9.1,33.34 9.1,31.54 9.8,30.84 9.8,29.54 11.1,28.24 11.1,26.74 v11.6,26.24
19  (via drill 0.4 pad 0.61)
  Top_Copper 0.254: U1.24 19.15,17.99 16.9,15.74 11.73,15.74 v11.5,15.74
  Top_Copper 0.305: RN4.4 9.83,13.84 11.73,15.74
  Bottom_Copper 0.305: v11.5,15.74 8.14,15.74 JP7.4
20  (via drill 0.4 pad 0.61)
  Top_Copper 0.254: v11.63,14.44 12.33,15.14 17.2,15.14 19.65,17.59 U1.25
  Top_Copper 0.305: RN4.3 10.63,13.44 v11.63,14.44
  Bottom_Copper 0.305: JP7.3 11.59,14.48 v11.63,14.44
21  (via drill 0.4 pad 0.61)
  Top_Copper 0.254: U1.2 14.48,31.72 14.8,32.04 14.8,33.04 14.3,33.64 12.5,33.64 11.8,34.34 v11.8,38.94
  Top_Copper 0.305: v11.8,38.94 RN1.4
  Bottom_Copper 0.254: v11.8,38.94 11.8,39.94 9.5,42.24 9.5,44.86 JP7.16
22  (via drill 0.4 pad 0.61)
  Top_Copper 0.254: v11,38.14 11,33.14 12.92,31.22 U1.3
  Top_Copper 0.305: v11,38.14 RN1.3
  Bottom_Copper 0.254: v11,38.14 11,39.44 8.6,41.84 8.6,43.22 JP7.15
23  (via drill 0.4 pad 0.61)
  Top_Copper 0.254: U1.4 12.62,30.72 10.2,33.14 10.2,37.94
  Top_Copper 0.305: RN1.2 v10.2,38.94 10.2,37.94
  Bottom_Copper 0.305: JP7.14 6.86,42.28 v10.2,38.94
24  (via drill 0.4 pad 0.61)
  Top_Copper 0.254: U1.62 16.65,38.06 | 16.65,38.06 16.65,39.39 16.9,39.64 RN5.1 | 16.65,38.06 16.82,38.06
  Top_Copper 0.305: 16.82,38.06 v16.85,38.09 | v29.1,38.14 v29.1,47.44
  Bottom_Copper 0.305: v16.85,38.09 29.25,38.09 v29.1,38.14 | v29.1,47.44 33.47,47.44 JP8.16
25  (via drill 0.4 pad 0.61)
  Top_Copper 0.254: U1.54 20.65,35.19 v20.5,35.34
  Top_Copper 0.305: RN6.2 v30.13,33.04 30.13,34.77 v30.2,34.84
  Bottom_Copper 0.254: v20.5,35.34 20.5,35.24 20.9,34.84 v30.2,34.84
  Bottom_Copper 0.305: v30.2,34.84 33.49,34.84 JP8.11 | 30.03,32.94 v30.13,33.04
26  (via drill 0.4 pad 0.61)
  Top_Copper 0.254: U1.51 22.15,35.49
  Top_Copper 0.305: RN6.3 29.33,32.17 v29.4,32.24 29.3,32.34 v29.3,35.64 | 22.15,35.49 v22.3,35.64
  Bottom_Copper 0.305: JP8.10 33.51,32.24 v29.4,32.24 29.3,32.34 | v22.3,35.64 v29.3,35.64
27  (via drill 0.4 pad 0.61)
  Top_Copper 0.254: U1.26 20.15,17.19 17.5,14.54 12.7,14.54 11.43,13.27 v11.43,11.94
  Top_Copper 0.305: RN4.2 v11.43,11.94
  Bottom_Copper 0.305: JP7.2 v11.43,11.94
28  (via drill 0.4 pad 0.61)
  Top_Copper 0.254: U1.27 20.65,16.59 18,13.94 13.1,13.94 12.23,13.07 RN4.1
  Top_Copper 0.305: v13,9.44 12.25,9.44 RN4.1
  Bottom_Copper 0.305: JP7.1 12.86,9.4 v13,9.44
31  (via drill 0.4 pad 0.61)
  Top_Copper 0.254: U1.33 25.1,17.44 27.7,14.84 27.7,11.24 v28.4,10.54 28.35,10.49 28.35,9.44
  Top_Copper 0.305: 28.35,9.44 RN8.4
  Bottom_Copper 0.254: JP8.1 29.54,9.4 v28.4,10.54
32  (via drill 0.4 pad 0.61)
  Top_Copper 0.254: U1.34 24.38,25.22 24.1,24.94 24.1,24.34 24.5,23.54 24.5,17.04 26.9,14.64 v26.9,11.94
  Top_Copper 0.305: RN8.3 v29.17,11.94
  Bottom_Copper 0.305: JP8.2 29.27,11.94 v29.17,11.94 v26.9,11.94
33  (via drill 0.4 pad 0.61)
  Top_Copper 0.254: U1.35 24.08,25.72 23.6,25.24 23.6,24.04 23.8,23.64 23.8,16.74 v26.1,14.44
  Top_Copper 0.305: RN8.2 v29.97,14.44
  Bottom_Copper 0.305: JP8.3 30.01,14.48 v29.97,14.44 v26.1,14.44
34  (via drill 0.4 pad 0.61)
  Top_Copper 0.254: U1.36 25.82,26.22 26.2,25.84 26.2,17.34 28.4,15.14 v28.4,13.04
  Top_Copper 0.305: RN8.1 v30.77,13.04 v30.77,17.04
  Bottom_Copper 0.305: JP8.4 31.05,17.02 v30.77,17.04 | v28.4,13.04 v30.77,13.04
35  (via drill 0.4 pad 0.61)
  Top_Copper 0.254: v27.58,19.74 27.58,26.36 27.22,26.72 U1.37
  Top_Copper 0.305: RN7.4 v27.58,19.74
  Bottom_Copper 0.305: JP8.5 27.76,19.56 v27.58,19.74
36  (via drill 0.4 pad 0.61)
  Top_Copper 0.254: v28.38,22.14 28.38,26.66 27.82,27.22 U1.38
  Top_Copper 0.305: RN7.3 v28.38,22.14
  Bottom_Copper 0.305: JP8.6 28.82,22.1 v28.38,22.14
37  (via drill 0.4 pad 0.61)
  Top_Copper 0.254: v29.18,24.74 29.18,26.76 28.22,27.72 U1.39
  Top_Copper 0.305: RN7.2 v29.18,24.74
  Bottom_Copper 0.305: JP8.7 29.28,24.64 v29.18,24.74
AD0  (via drill 0.4 pad 0.61)
  Top_Copper 0.254: U1.8 12.72,28.72 v12.4,29.04
  Bottom_Copper 0.254: JP1.1 10.4,47.26 10.4,42.74 12.5,40.64 12.5,29.14 v12.4,29.04
AD1  (via drill 0.4 pad 0.61)
  Top_Copper 0.254: U1.9 14.98,28.22
  Top_Copper 0.305: 14.98,28.22 v15,28.24
  Bottom_Copper 0.305: v15,28.24 15,34.24 13.1,36.14 13.1,47.14 7.7,52.54 5,52.54 4.3,51.84 4.3,50.82 JP1.2
BOOT0  (via drill 0.4 pad 0.61)
  Top_Copper 0.254: 29.98,26.86 28.62,28.22 U1.40 24.08,28.22 23.8,27.94 23.8,27.34 21.5,25.04 17.8,25.04 17.3,25.54 v17.3,32.14 17.65,32.49 U1.60
  Top_Copper 0.305: v29.98,26.74 29.98,26.86 | P2.P$2 34.87,57.57 v34.9,57.54 | R2.1 12.88,60.14 v12.95,60.07
  Bottom_Copper 0.305: JP8.8 30.42,27.18 v29.98,26.74 | v17.3,32.14 16.3,32.14 15.8,32.64 15.8,35.64 14.7,36.74 14.7,47.34 21.4,54.04 31.4,54.04 v34.9,57.54 | v34.9,57.54 34.8,57.54 | v34.9,57.54 34.9,58.32 34.54,58.67 24.76,58.67 24.13,58.04 15.75,58.04 13.72,60.07 v12.95,60.07
D+
  Top_Copper 0.203: USB.3 19.94,54.97
  Top_Copper 0.254: 19.94,54.97 19.89,54.92 R4.1
  Top_Copper 0.305: 19.86,54.84 R4.1 19.85,54.88
D-
  Top_Copper 0.203: USB.2 20.59,54.95
  Top_Copper 0.254: 20.59,54.95 R3.1
  Top_Copper 0.305: R3.1
DISC  (via drill 0.4 pad 0.61)
  Top_Copper 0.254: U1.53 21.15,38.29 v23.5,40.64 | v23.5,40.64 | R12.1 11.41,45.43 15.5,41.34 v15.5,40.64
  Bottom_Copper 0.305: v23.5,40.64 v15.5,40.64
GND  (via drill 0.4 pad 0.61)
  Top_Copper 0.254: 18.2,13.24 21.15,16.19 U1.28 21.15,24.09 | U2.7 21,11.84 20.8,12.04 20.8,13.44 22.65,15.29 U1.31 22.65,23.49 22,24.14 21.2,24.14 21.15,24.09 | 16.15,23.69 U1.18 16.15,21.39 15.7,20.94 15.21,20.94 | 16.15,23.69 16.6,24.14 16.91,24.14 | 16.91,24.14 17.19,24.14 | 17.19,24.14 21.1,24.14 21.15,24.09 | U1.12 15.62,26.72 16.41,26.72 16.46,26.77 16.46,24.21 16.31,24.05 | 16.15,23.69 16.15,26.19 | 16.15,35.88 U1.63 16.15,32.94 | U1.47 24.12,31.72 23.9,31.94 23.9,33.14 | 16.31,24.05 16.23,23.98 | 16.31,24.05 16.31,26.72 16.36,26.77 | 16.91,24.14 16.64,24.41 16.64,25.86 16.61,25.88 | 17.19,24.14 16.76,24.56 | 16.45,27.09 16.45,31.76 | 16.45,31.76 16.53,31.85 | 16.6,31.14 16.6,31.31 16.61,31.32 16.61,32.74 16.81,32.94 | 16.45,31.76 16.45,32.7 16.51,32.77 | 16.24,31.7 16.24,32.73 16.31,32.79
  Top_Copper 0.305: U2.7 | 18.2,13.24 17.29,13.14 U2.1 | v19.1,9.34 17.3,9.34 U2.4 17.24,9.28 LED1.C 14.95,9.24 v14,9.24 | C3.1 15.14,20.96 C5.1 15.21,20.94 | 16.15,35.88 C1.1 | 10.04,27.23 10.04,26.18 8.3,24.44 8.3,10.94 v8.7,10.54 | 16.6,27.24 16.6,31.14 16.6,31.34 16.24,31.7 16.15,31.79 16.15,32.94 16.5,32.94 v16.8,32.94 | 16.15,26.79 16.08,26.72 15.62,26.72 16.15,26.19 16.15,26.79 | 16.15,26.79 16.45,27.09 16.6,27.24 | Q1.2 11.7,46.24 14.8,43.14 JP11.1 | IC1.1 19.61,45.94 | 16.6,27.24 v16.6,25.74 | C6.1 23.9,35.21 23.9,33.14 v24.1,33.14
  Top_Copper 0.406: U2.7 24.75,11.84 C4.1 | U2.4 U2.3 U2.2 U2.1 | 33.6,56.49 R17.2
  Top_Copper 0.508: R2.2 v14.2,58.44 | v33.6,57.64 33.6,56.49
  Top_Copper 0.61: R17.2 36.4,56.44 38.6,54.24 JP9.3 | 7.7,7.04 8.7,8.04 v8.7,10.54 | JP4.1 | IC1.1 C7.2 | 19.61,45.94 JP11.1 | USB.P5 22.39,56.81 24.32,56.81 v24.55,57.04 24.55,59.27 v24.23,59.58 24.09,59.44 USB.P3 | USB.P6 16.49,56.79 14.84,58.44 v14.2,58.44 15.47,59.71 v15.6,59.71 16.11,59.71 16.38,59.44 USB.P4 USB.P2 | USB.P1 USB.P3 | 23.62,59.44 USB.P3
  Top_Copper 0.813: C7.2 24.42,47.06 Z1.A | LED2.C 10.23,55.55 R14.2 11.61,55.53 C8.2 | C8.2 11.95,55.56 F1.1 11.95,58.04 R2.2 | R9.1 11.9,55.51 C8.2 | JP2.1 1.78,9.06
  Top_Copper 0.991: 1.78,9.06 3.8,7.04 7.7,7.04 v26.8,7.04 v30.61,7.04
  Top_Copper 1.143: v38.6,7.04 JP4.1
  Top_Copper 1.27: JP4.1 JP4.2 JP4.3 JP4.4 JP4.5 JP4.6 JP4.7 JP4.8 JP4.9 JP4.10 JP4.11 JP4.12 JP4.13 JP4.14 JP4.15 JP4.16 JP9.3 | JP2.1 JP2.2 JP2.3 JP2.4 JP2.5 JP2.6 JP2.7 JP2.8 JP2.9 JP2.10 JP2.11 JP2.12 JP2.13 JP2.14 JP2.15 JP2.16
  Bottom_Copper 0.305: v8.7,10.54 13.1,10.54 14,9.64 v14,9.24 | 20.1,25.56 TP8.P$1 19.84,25.74 v16.6,25.74 | v16.8,32.94 17,33.14 v24.1,33.14
  Bottom_Copper 0.406: 1.8,9.38 JP2.1
  Bottom_Copper 0.61: JP9.3 36.37,53.04 22.3,53.04 16.98,47.72 16.98,43.3 JP11.1 | v33.6,57.64 33.1,57.14 24.65,57.14 v24.55,57.04
  Bottom_Copper 0.991: JP10.2 20.47,3.76 18.6,5.63 3.4,5.63 1.8,7.23 1.8,9.38
  Bottom_Copper 1.143: v26.8,7.04 v38.6,7.04 JP4.1
  other vias: 4.21,3.84 6.57,3.84 8.96,3.87 11.24,3.87 5.3,2.37 7.71,2.24 10.18,2.19 39.06,56.85 39.08,54.89 39.08,52.56 36.62,57.31 34.99,55.33 33.01,53.47 29.84,52.89 36.85,54.08 17.54,48.21 17.54,45.42 28.07,7.04 29.34,7.04 17.5,59.46 22.46,59.46 19.91,59.46
  pour Bottom_Copper (isolate 0.813, rank 6): -1.14,62.84 41.55,62.84 41.55,0.51 -1.14,0.51
  pour Top_Copper (isolate 0.813, rank 6): -1.6,62.94 41.78,62.94 41.78,0.1 -1.6,0.1
JTAG-TCK  (via drill 0.4 pad 0.61)
  Top_Copper 0.254: U1.49 23.15,31.19 22.6,30.64 v22.6,28.84
  Bottom_Copper 0.305: TP2.P$1 22.59,28.83 v22.6,28.84
JTAG-TDI  (via drill 0.4 pad 0.61)
  Top_Copper 0.254: U1.50 22.65,33.39 18.9,29.64 v18.9,28.14
  Bottom_Copper 0.305: v18.9,28.14 18.9,28.44 19.3,28.84 TP3.P$1
JTAG-TDO  (via drill 0.4 pad 0.61)
  Top_Copper 0.254: U1.55 20.15,31.99 v20.2,31.94
  Top_Copper 0.305: v22.2,31.94 21.8,31.54 21.8,28.04 v22.6,27.24
  Bottom_Copper 0.254: v20.2,31.94 v22.2,31.94
  Bottom_Copper 0.305: v22.6,27.24 21.47,27.24 TP4.P$1
JTAG-TMS  (via drill 0.4 pad 0.61)
  Top_Copper 0.254: U1.46 24.28,31.22 v23.4,30.34
  Bottom_Copper 0.305: v23.4,30.34 TP1.P$1
JTAG-TRST  (via drill 0.4 pad 0.61)
  Top_Copper 0.254: U1.7 15.78,29.22 | v18.1,30.34 18.1,31.24 19.65,32.79 U1.56 19.65,35.39 20.6,36.34 20.6,39.04 21.2,39.64 v21.2,41.34 | v15.9,47.04 15.9,49.94 | 15.9,49.94 16,50.04 | 15.9,49.94 v15.9,50.04 | v3.1,55.84 4.85,55.84 R13.1
  Top_Copper 0.305: 15.78,29.22 v15.8,29.24 | v18.1,27.24 v18.1,29.24 v18.1,30.34
  Top_Copper 0.813: R13.1 P1.P$1
  Bottom_Copper 0.254: v21.2,41.34 15.7,41.34 15.4,41.64 15.4,46.54 v15.9,47.04 | v15.9,50.04 11.8,50.04 8.5,53.34 2.3,53.34 1.8,53.84 1.8,54.54 v3.1,55.84
  Bottom_Copper 0.305: v15.8,29.24 v18.1,29.24 | TP5.P$1 18.16,27.3 v18.1,27.24 | TP6.P$1 18.11,30.35 v18.1,30.34
N$1
  Top_Copper 0.254: U1.6 11.2,29.72 11.07,29.72 R1.2 | 11.24,29.26 11.24,29.68
  Top_Copper 0.305: 11.24,29.68 11.2,29.72
N$2  (via drill 0.4 pad 0.61)
  Top_Copper 0.254: U1.1 13.7,32.74
  Top_Copper 0.305: 13.7,36.09 D1.C 13.7,36.09 v13.7,34.44 | 13.7,32.74 v13.7,32.94
  Bottom_Copper 0.305: v13.7,32.94 v13.7,34.44
N$3
  Top_Copper 0.813: R15.1 LED2.A
N$4  (via drill 0.4 pad 0.61)
  Top_Copper 0.203: U1.45 25.98,30.72 26.2,30.94 26.2,33.54 26,33.74 26,36.94 25.9,37.04 v25.9,46.04
  Top_Copper 0.254: v22.9,51.64 22.8,51.74 20.1,51.74 19.6,52.24 19.6,52.81 R4.2
  Top_Copper 0.813: R8.1 19.52,52.84 R4.2
  Bottom_Copper 0.254: v25.9,46.04 25.3,46.64 25.3,49.24 v22.9,51.64
N$5
  Top_Copper 0.61: 16.81,3.74 18.6,5.53 29.7,5.53 | 29.7,5.53 30.8,4.94 | JP15.2 30.77,5.11 31.7,6.04 | 31.7,6.04 31.7,49.24 30.4,50.54 R5.1 | 29.7,5.53 31.21,6.04 31.67,6.5 | 30.8,4.37 30.8,5.63 30.81,5.64 30.56,5.64 30.53,5.66 | 30.8,4.33 30.95,4.33 31.57,4.95 | 31.7,6.04 31.7,4.98 30.96,4.24 30.94,4.24 30.94,4.83 31.32,5.21 31.32,4.72 30.89,4.29
  Top_Copper 0.813: JP10.1 16.81,3.74 | 30.8,4.94 30.8,4.37 30.8,4.33 JP15.2
N$6
  Top_Copper 0.254: U1.5 12.32,30.22 11.2,31.34 9.3,31.34 8.9,30.94 8.9,30.29
  Top_Copper 0.305: 8.84,29.26 R1.1 8.9,30.29
N$8  (via drill 0.4 pad 0.61)
  Top_Copper 0.203: U1.44 26.38,30.22 26.7,30.54 26.7,33.84 26.5,34.04 26.5,47.64 26,48.14 v26,49.04
  Top_Copper 0.254: v25,52.04 24.5,52.54 21.13,52.54 R3.2
  Bottom_Copper 0.254: v26,49.04 26,51.04 v25,52.04
N$9
  Top_Copper 0.813: 25.9,50.54 Z1.C 22.6,50.54 | 25.9,50.54 R5.2 | IC1.3 22.6,50.54 | C7.1 22.3,50.24 22.6,50.54 | D2.C 26.3,50.74 26.1,50.74 | 26.1,50.74 | 26.1,50.74 25.9,50.54
N$11
  Top_Copper 0.305: R19.1 LED1.A
N$12
  Top_Copper 0.203: USB.5 18.64,55.85
  Top_Copper 0.406: F1.2 13.8,56.94 14.31,56.94 15.62,55.63 18.41,55.63 18.64,55.85
  Top_Copper 0.61: F1.2 13.75,57.09
N$14
  Top_Copper 0.61: Q2.1 16.66,52.39 R10.1 R9.2 11.9,51.04 11.5,50.64 10.8,50.64 Q1.3
N$15
  Top_Copper 0.813: R14.1 10.25,58.88 P1.P$2
N$16
  Top_Copper 0.813: Q2.2 18.21,54.68 R8.2
N$17
  Top_Copper 0.61: 9.76,48.45 Q1.1 | Q1.1 9.8,51.79 R11.1 | R12.2 9.74,48.43 Q1.1
N$19
  Top_Copper 0.61: R16.2 28.63,58.09 P2.P$1
RXD  (via drill 0.4 pad 0.61)
  Top_Copper 0.203: U1.43 26.98,29.72 27.2,29.94 27.2,34.04 27,34.24 27,42.54 27.1,42.64 v27.1,44.64 27.1,48.04
  Top_Copper 0.254: 27.1,48.04 v27,48.14
  Bottom_Copper 0.254: JP9.2 34.41,49.14 32.9,49.14 31.9,48.14 v27,48.14 | JP11.3 21.88,43.52 23,44.64 v27.1,44.64
SCL  (via drill 0.4 pad 0.61)
  Top_Copper 0.254: U1.29 21.65,15.89 19.4,13.64 v19.4,10.54
  Top_Copper 0.305: v20.8,10.54 22.43,10.54 U2.6
  Top_Copper 0.406: U2.6 24.82,10.57 R7.2
  Bottom_Copper 0.305: v19.4,10.54 v20.8,10.54
SDA
  Top_Copper 0.254: U1.30 22.15,15.59 20.1,13.54 20.1,9.64 20.4,9.34 22.43,9.34
  Top_Copper 0.305: 22.43,9.34 U2.5
  Top_Copper 0.406: U2.5 24.93,9.3 R6.2
TXD  (via drill 0.4 pad 0.61)
  Top_Copper 0.203: U1.42 27.38,29.22 27.7,29.54 v27.7,45.44 v27.7,48.84
  Bottom_Copper 0.254: 19.34,43 JP11.2 21.65,45.44 v27.7,45.44
  Bottom_Copper 0.305: JP9.1 33.5,50.54 31.47,48.84 v27.7,48.84
USB_P  (via drill 0.4 pad 0.61)
  Top_Copper 0.254: U1.52 21.65,37.79 v24.4,40.54
  Top_Copper 0.305: v28.4,40.54 28.4,54.04 30.2,55.84 30.2,56.39 R18.2
  Top_Copper 0.61: R18.2 R17.1
  Bottom_Copper 0.305: v24.4,40.54 v28.4,40.54
VBUS
  Top_Copper 0.406: 21.59,55.63 21.24,55.98 USB.1 | 21.59,55.63 21.91,55.63 22.03,55.5 | 21.59,55.63 21.91,55.31
  Top_Copper 0.813: D2.A 22.48,55.05 22.03,55.5
VCC  (via drill 0.4 pad 0.61)
  Top_Copper 0.254: 23.15,13.29 U1.32 23.15,23.79 v22.4,24.84 | U1.19 16.65,20.99 16.2,20.54 16.2,17.44 | L1.1 15.21,17.45 15.2,17.44 | U1.64 15.65,34.29 14.8,35.14 14.8,38.79 | U1.48 v25.1,33.94 25.1,35.69 C6.2 25.14,42.41 JP11.4 | v15.8,39.14 15.8,39.95 RN5.8 | 12.1,22.04 12.27,22.21 RN2.8 12.3,22.15 12.3,16.64
  Top_Copper 0.305: RN4.8 26.6,8.21 | 26.6,8.21 RN8.5 | R6.1 26.66,8.27 26.6,8.21 | 23.15,13.29 23.3,13.14 | RN3.5 RN3.6 RN3.7 RN3.8 11.74,16.64 12.3,16.64 12.4,16.64 | RN7.5 RN7.6 RN7.7 RN7.8 | 12.4,16.64 14.3,16.64 15.1,17.44 15.2,17.44 v16.25,17.44 16.2,17.44 | RN7.8 29.98,15.76 v30,15.74 | 23.65,13.49 23.7,13.54 v23.7,15.74 23.5,15.54 23.5,13.34 | 23.4,13.24 23.4,15.74 23.3,15.84 | 23.2,16.14 24.97,14.37 C4.2 | 24.45,13.81 24.12,13.81 23.9,14.04 23.9,15.14 | 23.9,15.14 23.8,15.24 | 23.9,15.14 24.7,14.34 24.4,14.04 24.2,14.04 24.1,14.14 24.1,14.54 | 24.1,14.64 24.1,14.54 | 24.1,14.54 24.4,14.24 | C4.2 24.97,13.71 24.8,13.54 24,13.54 23.5,13.04 | RN6.5 RN6.6 RN6.7 | RN6.7 RN6.8 | C4.2 25.22,13.81 26.1,12.94 26.1,11.26 R7.1 | 12.37,16.67 12.4,16.64 | RN2.5 RN2.6 RN2.7 RN2.8 | C5.2 15.16,17.84 L1.1 | RN1.8 RN1.7 RN1.6 RN1.5 | 11.82,41.04 RN1.5 | RN1.5 13.04,41.07 | 13.04,41.07 13.63,40.47 D1.A 13.83,39.76 14.8,38.79 15.56,38.02 C1.2 15.8,38.06 v15.8,39.14 | 13.04,41.07 13.37,41.07 14,40.44 | RN7.8 30.7,17.94 30.7,28.86 RN6.7 | RN5.8 RN5.7 RN5.6 RN5.5 19.31,41.25 | v13.9,41.54 13.8,41.44
  Top_Copper 0.406: RN4.5 RN4.6 RN4.7 RN4.8 | RN8.5 RN8.6 RN8.7 RN8.8 | R7.1 R6.1 | U2.8 22.49,13.14 23.3,13.14 23.4,13.24 23.5,13.34 23.65,13.49 23.97,13.81 24.45,13.81 C4.2 25.04,13.74 | 9.15,53.89 8.1,52.84 6.15,52.84 R13.2 | 13.83,39.76 13.83,41.41 13.8,41.44 | v13.9,45.74 13.9,47.99 IC1.4
  Top_Copper 0.61: R18.1 26.95,56.44 R16.1 | R15.2 9.15,53.89 | IC1.4 13.65,50.79 v13.6,50.84 | 13.6,39.99 D1.A | 13.97,55.24 v14.59,55.24
  Top_Copper 0.813: R15.2 10.35,54.14 R11.2 | Q2.3 14.59,54.09 R10.2 13.67,54.11 C8.1 13.97,55.24 | R13.2 v3.3,54.09 2.85,54.09 1.8,53.04 1.8,50.82 JP1.3 | R16.1 25.85,56.39 v24.7,55.24
  Bottom_Copper 0.305: v30,15.74 v23.7,15.74 22,17.44 v16.25,17.44 | v22.4,24.84 22.3,24.94 | 22.3,24.94 21.9,25.34 21.85,25.34 TP7.P$1 | 22.3,24.94 22.4,24.94 25.1,27.64 25.1,33.24 v25.1,33.94 19.2,33.94 15.8,37.34 v15.8,39.14
  Bottom_Copper 0.406: 13.5,52.84 13.6,52.94 | v13.9,41.54 v13.9,45.74
  Bottom_Copper 0.61: v13.6,50.84 13.6,52.94 13.6,54.25 v14.59,55.24 | v14.59,55.24 4.45,55.24 v3.3,54.09 | v24.7,55.24 24.6,55.24 24.4,55.04 14.79,55.04 v14.59,55.24
VCC/2  (via drill 0.4 pad 0.61)
  Top_Copper 0.61: 36.07,5.33 v35.8,5.36 | v34.92,5.36 v34.04,5.36 v33.15,5.36 33.04,5.36 33.02,5.33
  Top_Copper 0.991: JP6.1 36.07,5.33 33.02,5.33
  Top_Copper 1.27: JP5.1 JP5.2 JP5.3 JP5.4 JP5.5 JP5.6 JP5.7 JP5.8 JP5.9 JP5.10 JP5.11 JP5.12 JP5.13 JP5.14 JP5.15 JP5.16 | JP6.1 JP6.2 JP6.3 JP6.4 JP6.5 JP6.6 JP6.7 JP6.8 JP6.9 JP6.10 JP6.11 JP6.12 JP6.13 JP6.14 JP6.15 JP6.16
  Bottom_Copper 0.61: 25.41,6.66 26.16,5.36 28.4,4.47 | 25.41,6.66 26.41,5.66 | 25.41,6.66 23.95,6.04 23.83,7.43 | 24.38,7.57 23.82,7.77 23.62,7.77 25.78,5.61 | 23.85,6.27 26.39,5 28.44,4.52 | 28.44,4.52 JP15.1 | 28.44,4.52 28.44,5.1 26.59,4.37 25.68,6.43 24.74,7.37 24.54,7.37 24.51,7.34 25.78,5.61 | 25.78,5.61 23.85,6.27 | 23.85,6.27 26.62,4.77 24.08,4.93 25.86,4.42 23.8,4.42 22.35,7.14 24.92,7.14 26.44,5.61 26.42,5.61 27.69,4.75 28.42,4.01 28.42,4.11 27.63,4.6 28.9,5.1 28.85,5.16 | 24.38,3.68 28.26,4.25 25.91,4.06 27.33,4.06 27.63,3.1 27.63,3.81 28.88,5.1 28.14,5.1 27.99,5.26 | 4.32,8.51 4.32,8.53 | 4.32,8.53 | JP5.1
  Bottom_Copper 1.016: 4.32,8.53 5.28,7.57 23.69,7.57 | 24.38,7.57 23.69,7.57 | 23.69,7.57 23.83,7.43 | 24.38,3.68 JP10.3 22.88,4.35 19.68,7.54 20.95,7.54 | 27.43,3.68 JP15.1 | 20.95,7.54 21.97,7.54 24.64,4.88 26.82,4.88 | 27.08,4.88 26.82,4.88 | 26.82,4.88 24.64,7.06 23.14,7.06 23.06,7.14 23.55,7.14 25.25,5.44 | v35.8,5.36 26.16,5.36 | 24.15,4.35 20.95,7.54 | 4.32,8.51 JP5.1
  Bottom_Copper 2.032: 24.38,3.68 27.43,3.68
VDD
  Top_Copper 0.254: U1.13 15.22,26.22 15.6,25.84 15.6,24.44 13,21.84 13,18.64 13.21,18.43 L1.2 | 13.21,18.53 C3.2
  Top_Copper 0.305: 13.21,18.43 13.21,18.53

### Text on the board
tPlace: Power Rhythm 32 | V2.01
tNames: VCC | AD1 | AD0 | TXD | RXD | GND | 32 | 31 | 3 | 30 | GND TXD RXD VCC | 29 | 5 | 28 | 5 | 27 | 7 | 26 | Ai.Frame Team | 24 | 10 | 23 | 11 | 22 | 12 | 21 | 20 | 14 | 19 | 15 | 18 | 16 | 17 | VCC | GND | VS | GND | VS | S | S | VS | GND
bNames: JTAG-TRST | JTAG-TMS | JTAG-TDI | JTAG-TCK | JTAG-TRST | JTAG-TDO | GND | VCC
Holes: DRILL PLAN | SYM | SIZE | TOL. | CNT | PLATE | 0.016 in | +/-0.003 in | 131 | Yes | 0.040 in | +/-0.003 in | 108 | Yes | 0.047 in | +/-0.003 in | 3 | Yes | TOTAL | 242 | 242